# Altium schematic sheet FrontPanel.SchDoc
size A2; SheetNumber: 2; SheetTotal: 9
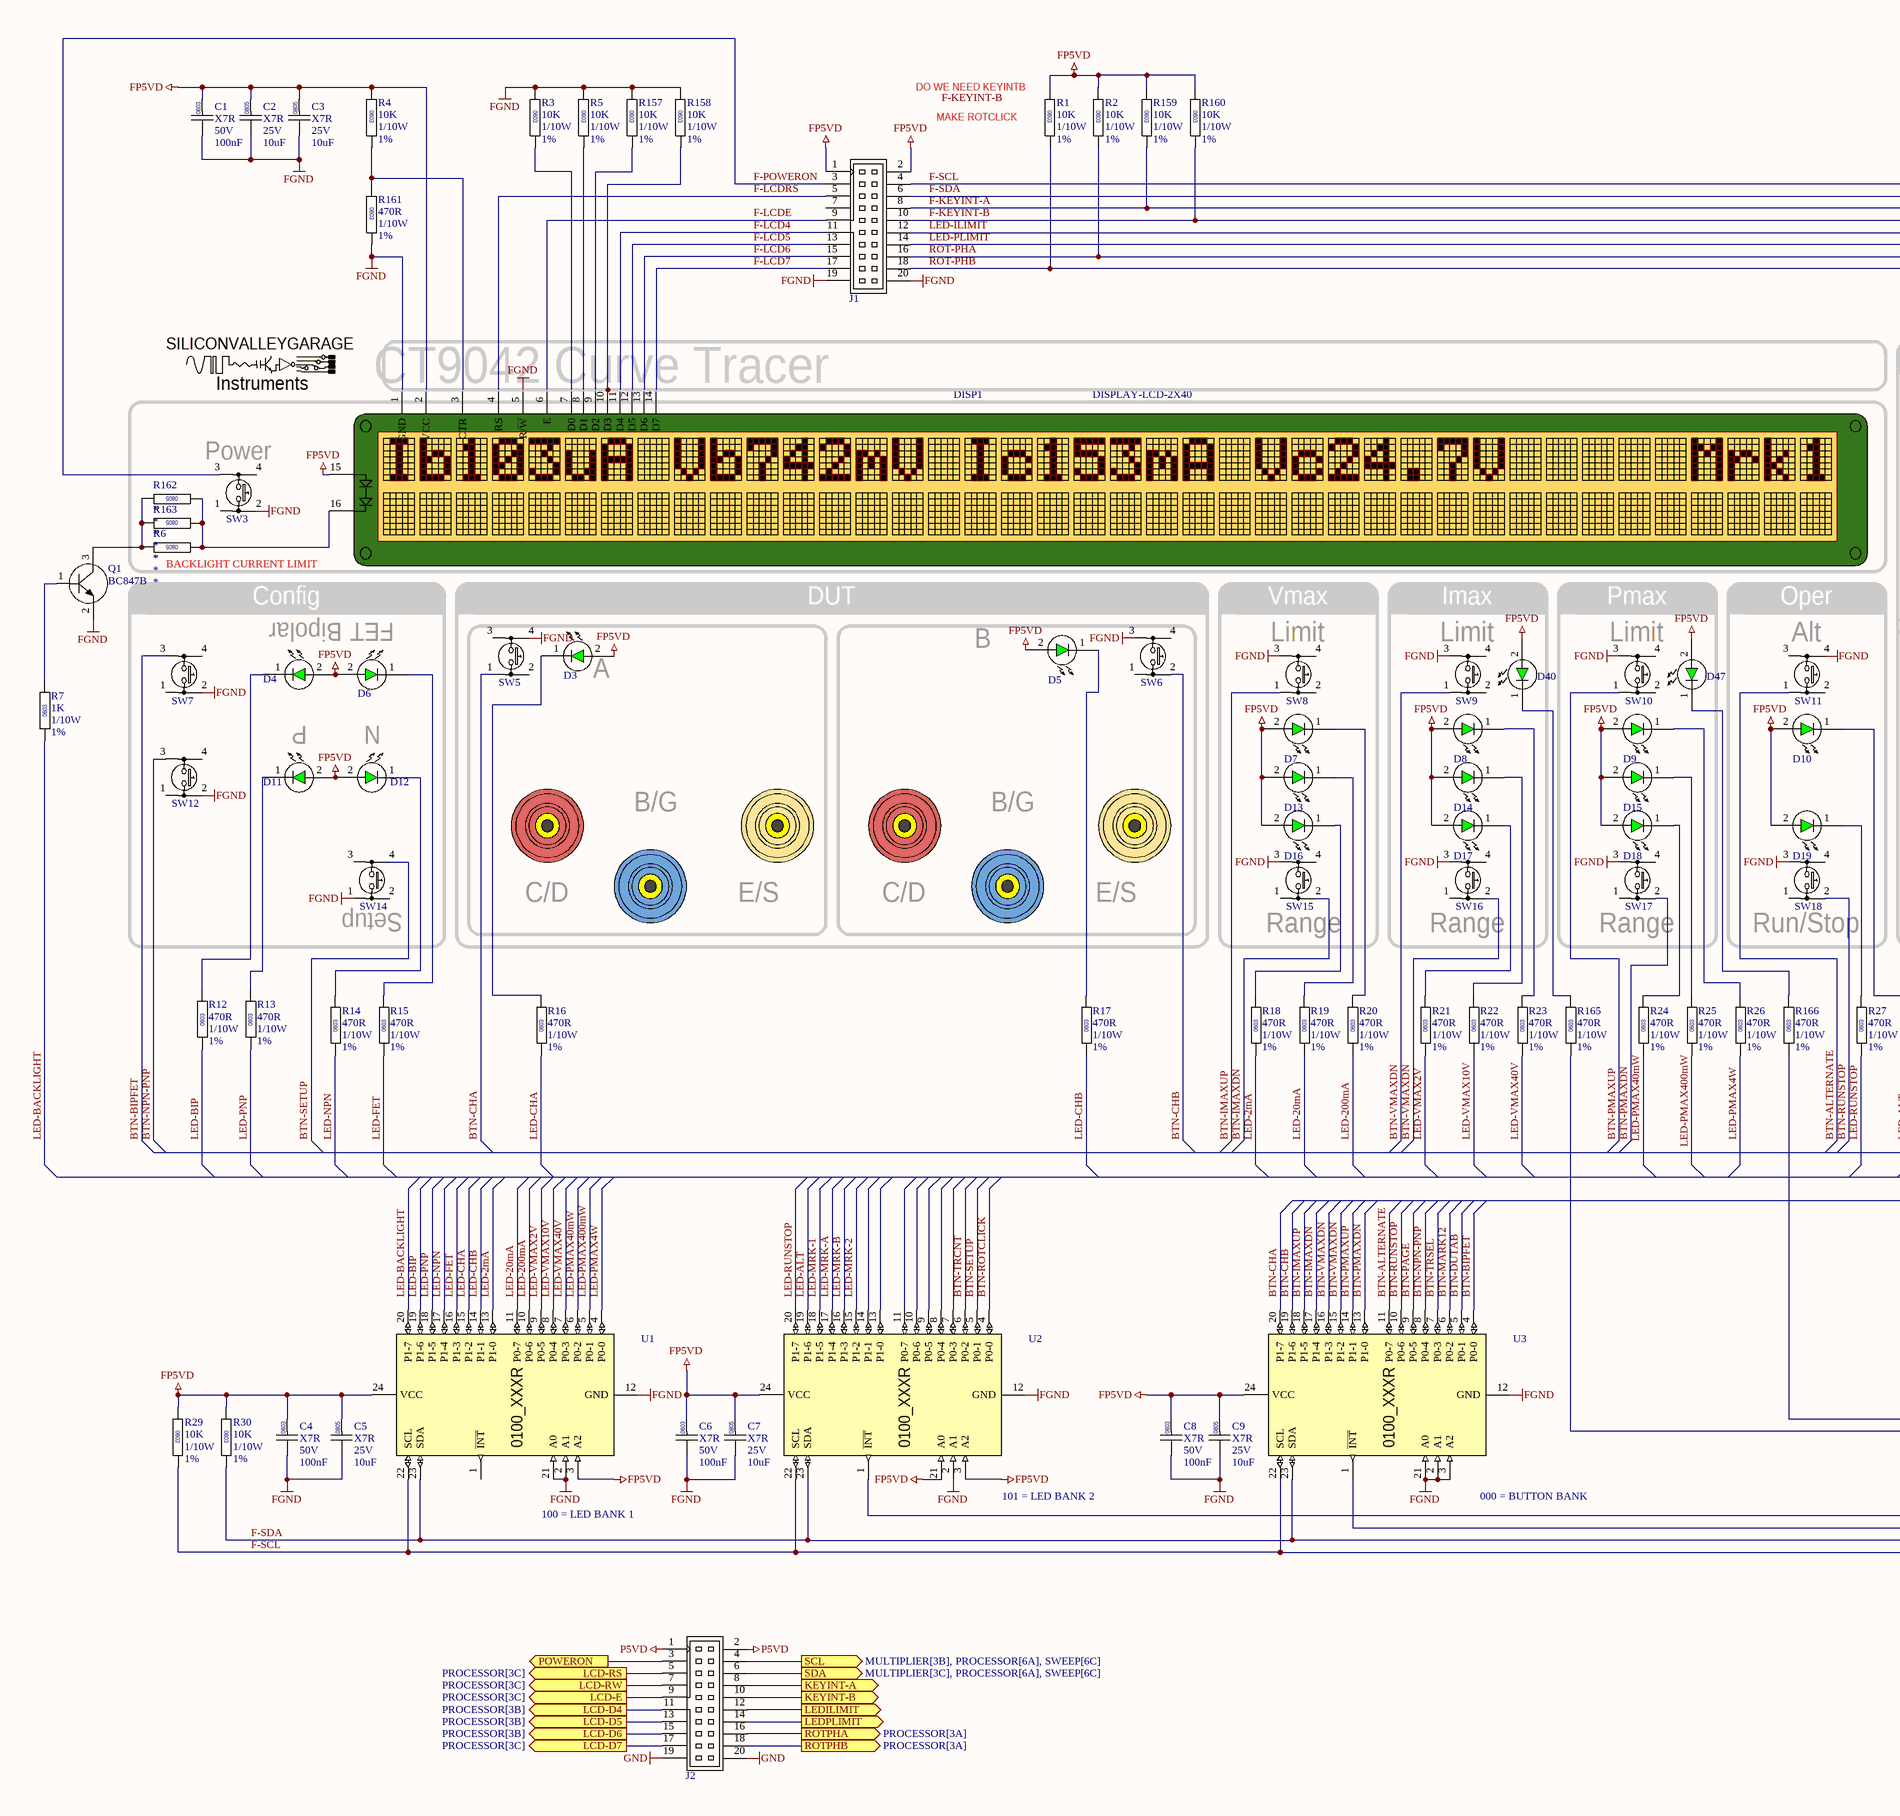
[diagram p0: FrontPanel.SchDoc, left]
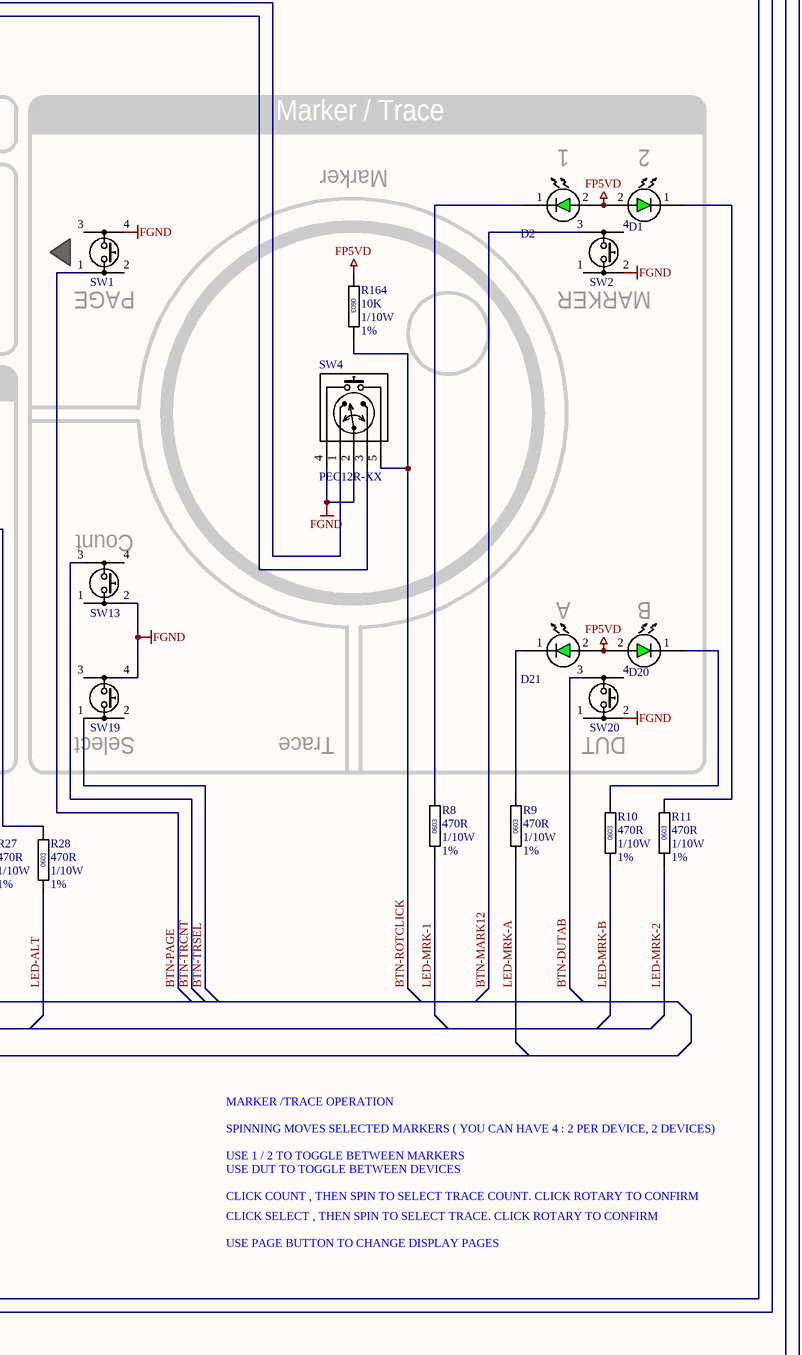
[diagram p1: FrontPanel.SchDoc, right]

## Parts
C1  Dielectric: X7R  Voltage: 50V  Capacitance: 100nF  [CAPC0603]  (hidden comment: CAP0603)
C2  Dielectric: X7R  Voltage: 25V  Capacitance: 10uF  [CAPC0805]  (hidden comment: CAP0805)
C3  Dielectric: X7R  Voltage: 25V  Capacitance: 10uF  [CAPC0805]  (hidden comment: CAP0805)
C4  Dielectric: X7R  Voltage: 50V  Capacitance: 100nF  [CAPC0603]  (hidden comment: CAP0603)
C5  Dielectric: X7R  Voltage: 25V  Capacitance: 10uF  [CAPC0805]  (hidden comment: CAP0805)
C6  Dielectric: X7R  Voltage: 50V  Capacitance: 100nF  [CAPC0603]  (hidden comment: CAP0603)
C7  Dielectric: X7R  Voltage: 25V  Capacitance: 10uF  [CAPC0805]  (hidden comment: CAP0805)
C8  Dielectric: X7R  Voltage: 50V  Capacitance: 100nF  [CAPC0603]  (hidden comment: CAP0603)
C9  Dielectric: X7R  Voltage: 25V  Capacitance: 10uF  [CAPC0805]  (hidden comment: CAP0805)
D1  LED-3MM-GREEN  [LED-3MM-GREEN]  (value not drawn)
D2  LED-3MM-GREEN  [LED-3MM-GREEN]  (value not drawn)
D3  LED-3MM-GREEN  [LED-3MM-GREEN]  (value not drawn)
D4  LED-3MM-GREEN  [LED-3MM-GREEN]  (value not drawn)
D5  LED-3MM-GREEN  [LED-3MM-GREEN]  (value not drawn)
D6  LED-3MM-GREEN  [LED-3MM-GREEN]  (value not drawn)
D7  LED-3MM-GREEN  [LED-3MM-GREEN]  (value not drawn)
D8  LED-3MM-GREEN  [LED-3MM-GREEN]  (value not drawn)
D9  LED-3MM-GREEN  [LED-3MM-GREEN]  (value not drawn)
D10  LED-3MM-GREEN  [LED-3MM-GREEN]  (value not drawn)
D11  LED-3MM-GREEN  [LED-3MM-GREEN]  (value not drawn)
D12  LED-3MM-GREEN  [LED-3MM-GREEN]  (value not drawn)
D13  LED-3MM-GREEN  [LED-3MM-GREEN]  (value not drawn)
D14  LED-3MM-GREEN  [LED-3MM-GREEN]  (value not drawn)
D15  LED-3MM-GREEN  [LED-3MM-GREEN]  (value not drawn)
D16  LED-3MM-GREEN  [LED-3MM-GREEN]  (value not drawn)
D17  LED-3MM-GREEN  [LED-3MM-GREEN]  (value not drawn)
D18  LED-3MM-GREEN  [LED-3MM-GREEN]  (value not drawn)
D19  LED-3MM-GREEN  [LED-3MM-GREEN]  (value not drawn)
D20  LED-3MM-GREEN  [LED-3MM-GREEN]  (value not drawn)
D21  LED-3MM-GREEN  [LED-3MM-GREEN]  (value not drawn)
D40  LED-3MM-GREEN  [LED-3MM-GREEN]  (value not drawn)
D47  LED-3MM-GREEN  [LED-3MM-GREEN]  (value not drawn)
DISP1  DISPLAY-LCD-2X40  [CONNECTOR-GENERIC-PINHEADER-2X8]
J1  BOXHEADER-10X2  [CONNECTOR GENERIC-BOXHEADER-2X10]  (value not drawn)
J2  BOXHEADER-10X2  [CONNECTOR GENERIC-BOXHEADER-2X10]  (value not drawn)
LOGO?  LOGO-SILICONVALLEYGARAGE-SMALL  [SILICONVALLEYGARAGE]  (value not drawn)  (graphical)
Q1  BC847B  [SOT23]
R1  value 10K  Power: 1/10W  Tolerance: 1%  [RESC0603]  (hidden comment: RESC0603)
R2  value 10K  Power: 1/10W  Tolerance: 1%  [RESC0603]  (hidden comment: RESC0603)
R3  value 10K  Power: 1/10W  Tolerance: 1%  [RESC0603]  (hidden comment: RESC0603)
R4  value 10K  Power: 1/10W  Tolerance: 1%  [RESC0603]  (hidden comment: RESC0603)
R5  value 10K  Power: 1/10W  Tolerance: 1%  [RESC0603]  (hidden comment: RESC0603)
R6  RESC0805  [RESC0805]  (value not drawn)
R7  value 1K  Power: 1/10W  Tolerance: 1%  [RESC0603]  (hidden comment: RESC0603)
R8  value 470R  Power: 1/10W  Tolerance: 1%  [RESC0603]  (hidden comment: RESC0603)
R9  value 470R  Power: 1/10W  Tolerance: 1%  [RESC0603]  (hidden comment: RESC0603)
R10  value 470R  Power: 1/10W  Tolerance: 1%  [RESC0603]  (hidden comment: RESC0603)
R11  value 470R  Power: 1/10W  Tolerance: 1%  [RESC0603]  (hidden comment: RESC0603)
R12  value 470R  Power: 1/10W  Tolerance: 1%  [RESC0603]  (hidden comment: RESC0603)
R13  value 470R  Power: 1/10W  Tolerance: 1%  [RESC0603]  (hidden comment: RESC0603)
R14  value 470R  Power: 1/10W  Tolerance: 1%  [RESC0603]  (hidden comment: RESC0603)
R15  value 470R  Power: 1/10W  Tolerance: 1%  [RESC0603]  (hidden comment: RESC0603)
R16  value 470R  Power: 1/10W  Tolerance: 1%  [RESC0603]  (hidden comment: RESC0603)
R17  value 470R  Power: 1/10W  Tolerance: 1%  [RESC0603]  (hidden comment: RESC0603)
R18  value 470R  Power: 1/10W  Tolerance: 1%  [RESC0603]  (hidden comment: RESC0603)
R19  value 470R  Power: 1/10W  Tolerance: 1%  [RESC0603]  (hidden comment: RESC0603)
R20  value 470R  Power: 1/10W  Tolerance: 1%  [RESC0603]  (hidden comment: RESC0603)
R21  value 470R  Power: 1/10W  Tolerance: 1%  [RESC0603]  (hidden comment: RESC0603)
R22  value 470R  Power: 1/10W  Tolerance: 1%  [RESC0603]  (hidden comment: RESC0603)
R23  value 470R  Power: 1/10W  Tolerance: 1%  [RESC0603]  (hidden comment: RESC0603)
R24  value 470R  Power: 1/10W  Tolerance: 1%  [RESC0603]  (hidden comment: RESC0603)
R25  value 470R  Power: 1/10W  Tolerance: 1%  [RESC0603]  (hidden comment: RESC0603)
R26  value 470R  Power: 1/10W  Tolerance: 1%  [RESC0603]  (hidden comment: RESC0603)
R27  value 470R  Power: 1/10W  Tolerance: 1%  [RESC0603]  (hidden comment: RESC0603)
R28  value 470R  Power: 1/10W  Tolerance: 1%  [RESC0603]  (hidden comment: RESC0603)
R29  value 10K  Power: 1/10W  Tolerance: 1%  [RESC0603]  (hidden comment: RESC0603)
R30  value 10K  Power: 1/10W  Tolerance: 1%  [RESC0603]  (hidden comment: RESC0603)
R157  value 10K  Power: 1/10W  Tolerance: 1%  [RESC0603]  (hidden comment: RESC0603)
R158  value 10K  Power: 1/10W  Tolerance: 1%  [RESC0603]  (hidden comment: RESC0603)
R159  value 10K  Power: 1/10W  Tolerance: 1%  [RESC0603]  (hidden comment: RESC0603)
R160  value 10K  Power: 1/10W  Tolerance: 1%  [RESC0603]  (hidden comment: RESC0603)
R161  value 470R  Power: 1/10W  Tolerance: 1%  [RESC0603]  (hidden comment: RESC0603)
R162  RESC0805  [RESC0805]  (value not drawn)
R163  RESC0805  [RESC0805]  (value not drawn)
R164  value 10K  Power: 1/10W  Tolerance: 1%  [RESC0603]  (hidden comment: RESC0603)
R165  value 470R  Power: 1/10W  Tolerance: 1%  [RESC0603]  (hidden comment: RESC0603)
R166  value 470R  Power: 1/10W  Tolerance: 1%  [RESC0603]  (hidden comment: RESC0603)
SW1  SWITCH-E-SWITCH-TL1105SFP  [SWITCH-ESWITCH-TL1105SPF-1RCAP]  (value not drawn)
SW2  SWITCH-E-SWITCH-TL1105SFP  [SWITCH-ESWITCH-TL1105SPF-1RCAP]  (value not drawn)
SW3  SWITCH-E-SWITCH-TL1105SFP  [SWITCH-ESWITCH-TL1105SPF-1RCAP]  (value not drawn)
SW4  PEC12R-XX
SW5  SWITCH-E-SWITCH-TL1105SFP  [SWITCH-ESWITCH-TL1105SPF-1RCAP]  (value not drawn)
SW6  SWITCH-E-SWITCH-TL1105SFP  [SWITCH-ESWITCH-TL1105SPF-1RCAP]  (value not drawn)
SW7  SWITCH-E-SWITCH-TL1105SFP  [SWITCH-ESWITCH-TL1105SPF-1RCAP]  (value not drawn)
SW8  SWITCH-E-SWITCH-TL1105SFP  [SWITCH-ESWITCH-TL1105SPF-1RCAP]  (value not drawn)
SW9  SWITCH-E-SWITCH-TL1105SFP  [SWITCH-ESWITCH-TL1105SPF-1RCAP]  (value not drawn)
SW10  SWITCH-E-SWITCH-TL1105SFP  [SWITCH-ESWITCH-TL1105SPF-1RCAP]  (value not drawn)
SW11  SWITCH-E-SWITCH-TL1105SFP  [SWITCH-ESWITCH-TL1105SPF-1RCAP]  (value not drawn)
SW12  SWITCH-E-SWITCH-TL1105SFP  [SWITCH-ESWITCH-TL1105SPF-1RCAP]  (value not drawn)
SW13  SWITCH-E-SWITCH-TL1105SFP  [SWITCH-ESWITCH-TL1105SPF-1RCAP]  (value not drawn)
SW14  SWITCH-E-SWITCH-TL1105SFP  [SWITCH-ESWITCH-TL1105SPF-1RCAP]  (value not drawn)
SW15  SWITCH-E-SWITCH-TL1105SFP  [SWITCH-ESWITCH-TL1105SPF-1RCAP]  (value not drawn)
SW16  SWITCH-E-SWITCH-TL1105SFP  [SWITCH-ESWITCH-TL1105SPF-1RCAP]  (value not drawn)
SW17  SWITCH-E-SWITCH-TL1105SFP  [SWITCH-ESWITCH-TL1105SPF-1RCAP]  (value not drawn)
SW18  SWITCH-E-SWITCH-TL1105SFP  [SWITCH-ESWITCH-TL1105SPF-1RCAP]  (value not drawn)
SW19  SWITCH-E-SWITCH-TL1105SFP  [SWITCH-ESWITCH-TL1105SPF-1RCAP]  (value not drawn)
SW20  SWITCH-E-SWITCH-TL1105SFP  [SWITCH-ESWITCH-TL1105SPF-1RCAP]  (value not drawn)
U1  PCAL9555  (value not drawn)
U2  PCAL9555  (value not drawn)
U3  PCAL9555  (value not drawn)

## Blocks framed on the sheet
Marker / Trace: D1 D2 D20 D21 R164 SW1 SW2 SW4 SW13 SW19 SW20
Power: DISP1 R6 R162 R163 SW3

## Ports
KEYINT-A (out), KEYINT-B (out), LCD-D4 (out, see PROCESSOR[3B]), LCD-D5 (out, see PROCESSOR[3B]), LCD-D6 (out, see PROCESSOR[3B]), LCD-D7 (out, see PROCESSOR[3C]), LCD-E (out, see PROCESSOR[3C]), LCD-RS (out, see PROCESSOR[3C]), LCD-RW (out, see PROCESSOR[3C]), LEDILIMIT (out), LEDPLIMIT (out), POWERON (out), ROTPHA (out, see PROCESSOR[3A]), ROTPHB (out, see PROCESSOR[3A]), SCL (out, see MULTIPLIER[3B], PROCESSOR[6A], SWEEP[6C]), SDA (out, see MULTIPLIER[3C], PROCESSOR[6A], SWEEP[6C])

## Nets
FGND: C1.2 C2.2 C3.2 C4.2 C5.2 C6.2 C7.2 C8.2 C9.2 DISP1.1(GND) DISP1.5(R/~{W}) J1.19(-) J1.20(-) Q1.2(E) R3.2 R5.2 R157.2 R158.2 R161.1 SW1.4 SW2.2 SW3.2 SW4.2 SW4.4 SW5.4 SW6.3 SW7.2 SW8.3 SW9.3 SW10.3 SW11.4 SW12.2 SW13.2 SW14.1 SW15.3 SW16.3 SW17.3 SW18.3 SW19.4 SW20.2 U1.2(A1) U1.12(GND) U1.21(A0) U2.2(A1) U2.12(GND) U3.2(A1) U3.3(A2) U3.12(GND) U3.21(A0)
FP5VD: C1.1 C2.1 C3.1 C4.1 C5.1 C6.1 C7.1 C8.1 C9.1 D1.2(K) D2.2(K) D3.2(K) D4.2(K) D5.2(K) D6.2(K) D7.2(K) D8.2(K) D9.2(K) D10.2(K) D11.2(K) D12.2(K) D13.2(K) D14.2(K) D15.2(K) D16.2(K) D17.2(K) D18.2(K) D19.2(K) D20.2(K) D21.2(K) D40.2(K) D47.2(K) DISP1.2(VCC) DISP1.15(LED+) J1.1(+) J1.2(-) R1.2 R2.2 R4.2 R29.2 R30.2 R159.2 R160.2 R164.2 U1.3(A2) U1.24(VCC) U2.3(A2) U2.21(A0) U2.24(VCC) U3.24(VCC)
GND: J2.19(-) J2.20(-)
P5VD: J2.1(+) J2.2(-)
BTN-ALTERNATE: SW11.1 U3.11(P0-7)
BTN-BIPFET: SW7.3 U3.4(P0-0)
BTN-CHA: SW5.1 U3.20(P1-7)
BTN-CHB: SW6.2 U3.19(P1-6)
BTN-DUTAB: SW20.3 U3.5(P0-1)
BTN-IMAXDN: SW15.2 U3.17(P1-4)
BTN-IMAXUP: SW8.1 U3.18(P1-5)
BTN-MARK12: SW2.3 U3.6(P0-2)
BTN-NPN-PNP: SW12.3 U3.8(P0-4)
BTN-PAGE: SW1.1 U3.9(P0-5)
BTN-PMAXDN: SW17.2 U3.13(P1-0)
BTN-PMAXUP: SW10.1 U3.14(P1-1)
BTN-ROTCLICK: R164.1 SW4.5 U2.4(P0-0)
BTN-RUNSTOP: SW18.2 U3.10(P0-6)
BTN-SETUP: SW14.4 U2.5(P0-1)
BTN-TRCNT: SW13.3 U2.6(P0-2)
BTN-TRSEL: SW19.1 U3.7(P0-3)
BTN-VMAXDN: SW9.1 SW16.2 U3.15(P1-2) U3.16(P1-3)
F-KEYINT-A: J1.8(-) R159.1 U3.1(~{INT})
F-KEYINT-B: J1.10(-) R160.1 U2.1(~{INT})
F-LCD4: DISP1.11(D4) J1.11(-)
F-LCD5: DISP1.12(D5) J1.13(-)
F-LCD6: DISP1.13(D6) J1.15(-)
F-LCD7: DISP1.14(D7) J1.17(-)
F-LCDE: DISP1.6(E) J1.9(-)
F-LCDRS: DISP1.4(RS) J1.5(-)
F-POWERON: J1.3(-) SW3.3
F-SCL: J1.4(-) R29.1 U1.22(SCL) U2.22(SCL) U3.22(SCL)
F-SDA: J1.6(-) R30.1 U1.23(SDA) U2.23(SDA) U3.23(SDA)
KEYINT-A: J2.8(-) ; port KEYINT-A
KEYINT-B: J2.10(-) ; port KEYINT-B
LCD-D4: J2.11(-) ; port LCD-D4
LCD-D5: J2.13(-) ; port LCD-D5
LCD-D6: J2.15(-) ; port LCD-D6
LCD-D7: J2.17(-) ; port LCD-D7
LCD-E: J2.9(-) ; port LCD-E
LCD-RS: J2.5(-) ; port LCD-RS
LCD-RW: J2.7(-) ; port LCD-RW
LED-2mA: R18.2 U1.13(P1-0)
LED-20mA: R19.2 U1.11(P0-7)
LED-200mA: R20.2 U1.10(P0-6)
LED-ALT: R28.2 U2.19(P1-6)
LED-BACKLIGHT: R7.2 U1.20(P1-7)
LED-BIP: R12.2 U1.19(P1-6)
LED-CHA: R16.2 U1.15(P1-2)
LED-CHB: R17.2 U1.14(P1-1)
LED-FET: R15.2 U1.16(P1-3)
LED-ILIMIT: J1.12(-) R165.2
LED-MRK-1: R8.2 U2.18(P1-5)
LED-MRK-2: R11.2 U2.15(P1-2)
LED-MRK-A: R9.2 U2.17(P1-4)
LED-MRK-B: R10.2 U2.16(P1-3)
LED-NPN: R14.2 U1.17(P1-4)
LED-PLIMIT: J1.14(-) R166.2
LED-PMAX4W: R26.2 U1.4(P0-0)
LED-PMAX40mW: R24.2 U1.6(P0-2)
LED-PMAX400mW: R25.2 U1.5(P0-1)
LED-PNP: R13.2 U1.18(P1-5)
LED-RUNSTOP: R27.2 U2.20(P1-7)
LED-VMAX2V: R21.2 U1.9(P0-5)
LED-VMAX10V: R22.2 U1.8(P0-4)
LED-VMAX40V: R23.2 U1.7(P0-3)
LEDILIMIT: J2.12(-) ; port LEDILIMIT
LEDPLIMIT: J2.14(-) ; port LEDPLIMIT
POWERON: J2.3(-) ; port POWERON
ROT-PHA: J1.16(-) R2.1 SW4.1
ROT-PHB: J1.18(-) R1.1 SW4.3
ROTPHA: J2.16(-) ; port ROTPHA
ROTPHB: J2.18(-) ; port ROTPHB
SCL: J2.4(-) ; port SCL
SDA: J2.6(-) ; port SDA
NetD1_1: D1.1(A) R11.1
NetD2_1: D2.1(A) R8.1
NetD3_1: D3.1(A) R16.1
NetD4_1: D4.1(A) R12.1
NetD5_1: D5.1(A) R17.1
NetD6_1: D6.1(A) R15.1
NetD7_1: D7.1(A) R20.1
NetD8_1: D8.1(A) R23.1
NetD9_1: D9.1(A) R26.1
NetD10_1: D10.1(A) R28.1
NetD11_1: D11.1(A) R13.1
NetD12_1: D12.1(A) R14.1
NetD13_1: D13.1(A) R19.1
NetD14_1: D14.1(A) R22.1
NetD15_1: D15.1(A) R25.1
NetD16_1: D16.1(A) R18.1
NetD17_1: D17.1(A) R21.1
NetD18_1: D18.1(A) R24.1
NetD19_1: D19.1(A) R27.1
NetD20_1: D20.1(A) R10.1
NetD21_1: D21.1(A) R9.1
NetD40_1: D40.1(A) R165.1
NetD47_1: D47.1(A) R166.1
NetDISP1_3: DISP1.3(CTR) R4.1 R161.2
NetDISP1_7: DISP1.7(D0) R3.1
NetDISP1_8: DISP1.8(D1) R5.1
NetDISP1_9: DISP1.9(D2) R157.1
NetDISP1_10: DISP1.10(D3) R158.1
NetDISP1_16: DISP1.16(LED-) R6.2 R162.2 R163.2
NetQ1_1: Q1.1(B) R7.1
NetQ1_3: Q1.3(C) R6.1 R162.1 R163.1

Not connected (* = marked no-connect by the designer): J1 7(-); SW1 2 3; SW2 1 4; SW3 1 4; SW5 2 3; SW6 1 4; SW7 1 4; SW8 2 4; SW9 2 4; SW10 2 4; SW11 2 3; SW12 1 4; SW13 1 4; SW14 2 3; SW15 1 4; SW16 1 4; SW17 1 4; SW18 1 4; SW19 2 3; SW20 1 4; U1 1(~{INT}); U2 7(P0-3) 8(P0-4) 9(P0-5) 10(P0-6) 11(P0-7) 13(P1-0) 14(P1-1)

## Notes on the sheet
- (near R1) DO WE NEED KEYINTB
- (near R1) MAKE ROTCLICK
- (near LOGO?) Instruments
- (near DISP1) CT9042 Curve Tracer
- (near D2) 1
- (near D1) 2
- Marker
- (near SW1) PAGE
- (near SW2) MARKER
- (near R6) BACKLIGHT CURRENT LIMIT
- Config
- Bipolar
- (near D6) FET
- DUT
- B
- (near SW8) Vmax
- (near SW8) Limit
- Imax
- (near SW9) Limit
- Pmax
- (near SW10) Limit
- (near SW11) Alt
- (near SW11) Oper
- (near D3) A
- (near D11) P
- (near D12) N
- (near SW13) Count
- B/G
- (near D21) A
- (near D20) B
- (near SW14) Setup
- C/D
- E/S
- (near SW15) Range
- (near SW16) Range
- (near SW17) Range
- (near SW18) Run/Stop
- (near SW19) Select
- Trace
- (near SW20) DUT
- MARKER /TRACE OPERATION
- USE 1 / 2 TO TOGGLE BETWEEN MARKERS
- USE DUT TO TOGGLE BETWEEN DEVICES
- SPINNING MOVES SELECTED MARKERS ( YOU CAN HAVE 4 : 2 PER DEVICE, 2 DEVICES)
- CLICK COUNT , THEN SPIN TO SELECT TRACE COUNT. CLICK ROTARY TO CONFIRM
- CLICK SELECT , THEN SPIN TO SELECT TRACE. CLICK ROTARY TO CONFIRM
- USE PAGE BUTTON TO CHANGE DISPLAY PAGES
- 100 = LED BANK 1
- (near U2) 101 = LED BANK 2
- (near U3) 000 = BUTTON BANK
- Labels drawn without touching a wire or pin: F-KEYINT-B
- (in symbol CAPC-0805-10uF-25V) 0805
- (in symbol IC-NEXPERIA-PCAL9555A) 0100_XXXR
- (in symbol LOGO-SILICONVALLEYGARAGE-SMALL) SILICONVALLEYGARAGE
- (in symbol RESC-0603-1K-1%-1/10W) 0603
- (in symbol RESC-0603-10K-1%-1/10W) 0603
- (in symbol RESC-0603-470R-1%-1/10W) 0603
- (in symbol RESC-0805-GENERIC) 0805

## Library data of the parts
C1 C4 C6 C8 = CAPC-0603-100nF-50V-X7R: CAPACITOR,CERAMIC,100nF,50V,X7R,0603; Manufacturer 1: KEMET; Manufacturer Part Number 1: C0603C104K5RACTU; Package / Case: 0603; Location: *; Supplier 1: Mouser; Supplier Part Number 1: 80-C0603C104K5R7867; Supplier 2: Mouser; Supplier Part Number 2: 80-C0603C104K5R7411; Supplier 3: Avnet; Supplier Part Number 3: KGM15BR71H104KT; Supplier 4: Digikey; Supplier Part Number 4: 1276-1000-1-ND; LCSC: C127833; MOUSER: 80-C0603C104K5R
C2 C3 C5 C7 C9 = CAPC-0805-10uF-25V: CAPACITOR,CERAMIC,10uF,25V,X5R,0805; Manufacturer 1: SAMSUNG; Manufacturer Part Number 1: CL21B106KAYQNNE; Package / Case: 0805 (2012 metric); Location: *; LCSC: C3039694; MOUSER: 187-CL21B106KAYQNNE
D1-D21 D40 D47 = LED-3MM-GREEN: LED,TH,GREEN,42mCd,3MM; Manufacturer 1: WURTH; Manufacturer Part Number 1: 151031VS06000; MOUSER: 78-VLMPG33N1P2; Supplier 1: Mouser; Supplier Part Number 1: 78-VLMPG33N1P2
DISP1 = DISPLAY-LCD-2X40: DISPLAY,LCD,ALPHA,2X40CHAR,HD44780,YELLOW BL
J1 J2 = CONN-BOXHEADER-10X2
LOGO? = LOGO-SILICONVALLEYGARAGE-SMALL: LOGO,SILICONVALLEYGARAGE,SMALL
Q1 = XSTR-NPN-BC847: XSTR,NPN,45V,0.1A,,BC847B,SOT23
R1-R5 R29 R30 R157-R160 R164 = RESC-0603-10K-1%-1/10W: RESISTOR,10K,1%,100mW,0603 (1608); Manufacturer 1: YAGEO; Manufacturer Part Number 1: RC0603FR-0710KL; Location: *; LCSC: C25804; MOUSER: 603-RC0603FR-0710KL
R6 R162 R163 = RESC-0805-GENERIC: RESISTOR,GENERIC,0805; Location: *; Parameter 4: *; Power: *; Tolerance: *; Value: *
R7 = RESC-0603-1K-1%-1/10W: RESISTOR,1K,1%,100mW,0603 (1608); Manufacturer 1: YAGEO; Manufacturer Part Number 1: RC0603FR-071KL; Location: *; LCSC: C21190; MOUSER: 603-RC0603FR-071KL
R8-R28 R161 R165 R166 = RESC-0603-470R-1%-1/10W: RESISTOR,470R,1%,100mW,0603 (1608); Location: *; LCSC: C23179
SW1-SW3 SW5-SW20 = SWITCH-E-SWITCH-TL1105SFP: SW,SMD,TACT,4PIN,TH,160g TOP ACTUATOR FOR CAP,E-SWITCH,TL1105SPF160; Manufacturer Part Number 1: TL1105SPF160Q; DIGIKEY: EG1861-ND; Manufacturer 1: E-SWITCH
SW4 = SWITCH-BOURNS-PEC12R
U1-U3 = IC-NEXPERIA-PCAL9555A: I2C,16BIT AGILE I/O EXPANDER,INT,NEXPERIA,PCAL95555,TSSOP24; Manufacturer Part Number 1: PCAL9555APW,118; DIGIKEY: 568-9928-1-ND; LCSC: C2669740; Manufacturer 1: NEXPERIA